# EAGLE design untitled (EAGLE 9.6.2)
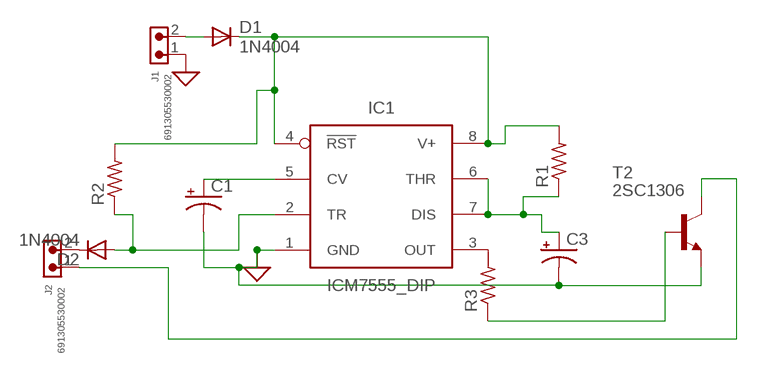
[diagram p0: schematic, sheet 1]

## Parts
C1  CAPACITOR-PE2.5-5  [E2,5-5]
C3  CAPACITOR-PE2.5-5  [E2,5-5]
D1  1N4004  [DO41-10]
D2  1N4004  [DO41-10]
IC1  ICM7555_DIP  [DIP826W53P254L959H508Q8B]
J1  691305530002  691305530002  [691305530002]
J2  691305530002  691305530002  [691305530002]
R1  R-US_0207/7  [0207/7]
R2  R-US_0207/7  [0207/7]
R3  R-US_0207/12  [0207/12]
T2  2SC1306  [TO220BV]

## Nets
GND: C1.- C3.- IC1.1(GND) J1.1 T2.3(E) ; supply symbol labelled SUP
N$1: D1.A J1.2
N$2: D1.C IC1.4(!RST) IC1.8(V+) R1.2 R2.2
N$3: C1.+ IC1.5(CV)
N$4: D2.C J2.2
N$5: C3.+ IC1.6(THR) IC1.7(DIS) R1.1
N$6: J2.1 T2.2(C)
N$7: D2.A IC1.2(TR) R2.1
N$8: IC1.3(OUT) R3.2
N$9: R3.1 T2.1(B)

## Library data of the parts
C1 C3 = BeagleBone_Blue_R3:CAPACITOR-P: POLARIZED CAPACITOR, American symbol
D1 D2 = adafruit:1N4004: DIODE General purpose 1N400x type rectifier (With bigger pads) http://www.ladyada.net/library/pcb/eaglelibrary.html
IC1 = IC_Clock-Timing:*555: TIMER 555 General purpose precision timers NE555 : Texas Datasheet <http://www.ti.com/general/docs/suppproductinfo.tsp?distId=10&gotoUrl=http%3A%2F%2Fwww.ti.com%2Flit%2Fgpn%2Fne555>, Diodes Incorporated Datasheet <https://www.diodes.com/assets/Datasheets/NE555_SA555_NA555.pdf> LM555 Datasheet <http://www.ti.com/general/docs/suppproductinfo.tsp?distId=10&gotoUrl=http%3A%2F%2Fwww.ti.com%2Flit%2Fgpn%2Flm555> LMC555 Datasheet <http://www.ti.com/general/docs/suppproductinfo.tsp?distId=10&gotoUrl=http%3A%2F%2Fwww.ti.com%2Flit%2Fgpn%2Flmc555> ICM7555 : Maxim Integrated Datasheet <https://datasheets.maximintegrated.com/en/ds/ICM7555-ICM7556.pdf>, Renesas Electronics America Inc Datasheet <https://www.renesas.com/en-us/www/doc/datasheet/icm7555-56.pdf>; CATEGORY: IC_Clock-Timing; CURRENT-SUPPLY: 60µA; DESCRIPTION: IC OSC SINGLE TIMER 1MHZ 8DIP; FREQUENCY: 1MHz; MANUFACTURER: Renesas Electronics America Inc; MPN: ICM7555IPAZ; OPERATING_TEMP: -25°C to 85°C; PART_STATUS: Active; ROHS_COMPLIANT: ROHS3 Compliant; SUB-CATEGORY: Timer
J1 J2 = Wurth_Connectors_WR-TBL Pluggable Connector:691305530002: WR-TBL Serie 3055 - 5,08 mm - PCB Header Vertical Entry with Plastic Latches KIND PROPERTIES Pitch 5.08 mm MATERIAL PROPERTIES Insulator Material PA66 Insulator Flammability Rating UL94 V-0 Insulator Color Green Terminal Material Copper Alloy Terminal Plating Tin-plated surface GENERAL INFORMATION Operating Temperature -40 up to +105 °C ELECTRICAL PROPERTIES IR UL 16 A Working Voltage [UL] 300 V (AC) Withstanding Voltage [UL] 2500 V (AC) Contact Resistance [UL] 20 mΩ CERTIFICATION UL Approval E315414 <https://www.we-online.com/catalog/media/o135349v209%20Family_WR-TBL3_6913055300xx.jpg> Details see: https://www.we-online.com/catalog/en/TBL_5_08_3055_6913055300XX/ Updated by Ella Wu 2019-12-30 2019(C) Wurth Elektronik; DATASHEET-URL: https://www.we-online.com/catalog/datasheet/691305530002.pdf; IR-UL: 16A; MOUNT: THT; PART-NUMBER: 691305530002; PINS: 2; PITCH: 5.08mm; TYPE: Vertical; WORKING-VOLTAGE-UL: 300V (AC)
R1 R2 = adafruit:R-US_: RESISTOR, American symbol
R3 = BeagleBone_Black_Wireless:R-US_: RESISTOR, American symbol
T2 = transistor-neu-to92:2SC1306: NPN Transistor Final RF Power Outupt Source: 2sc1306.pdf

## Board
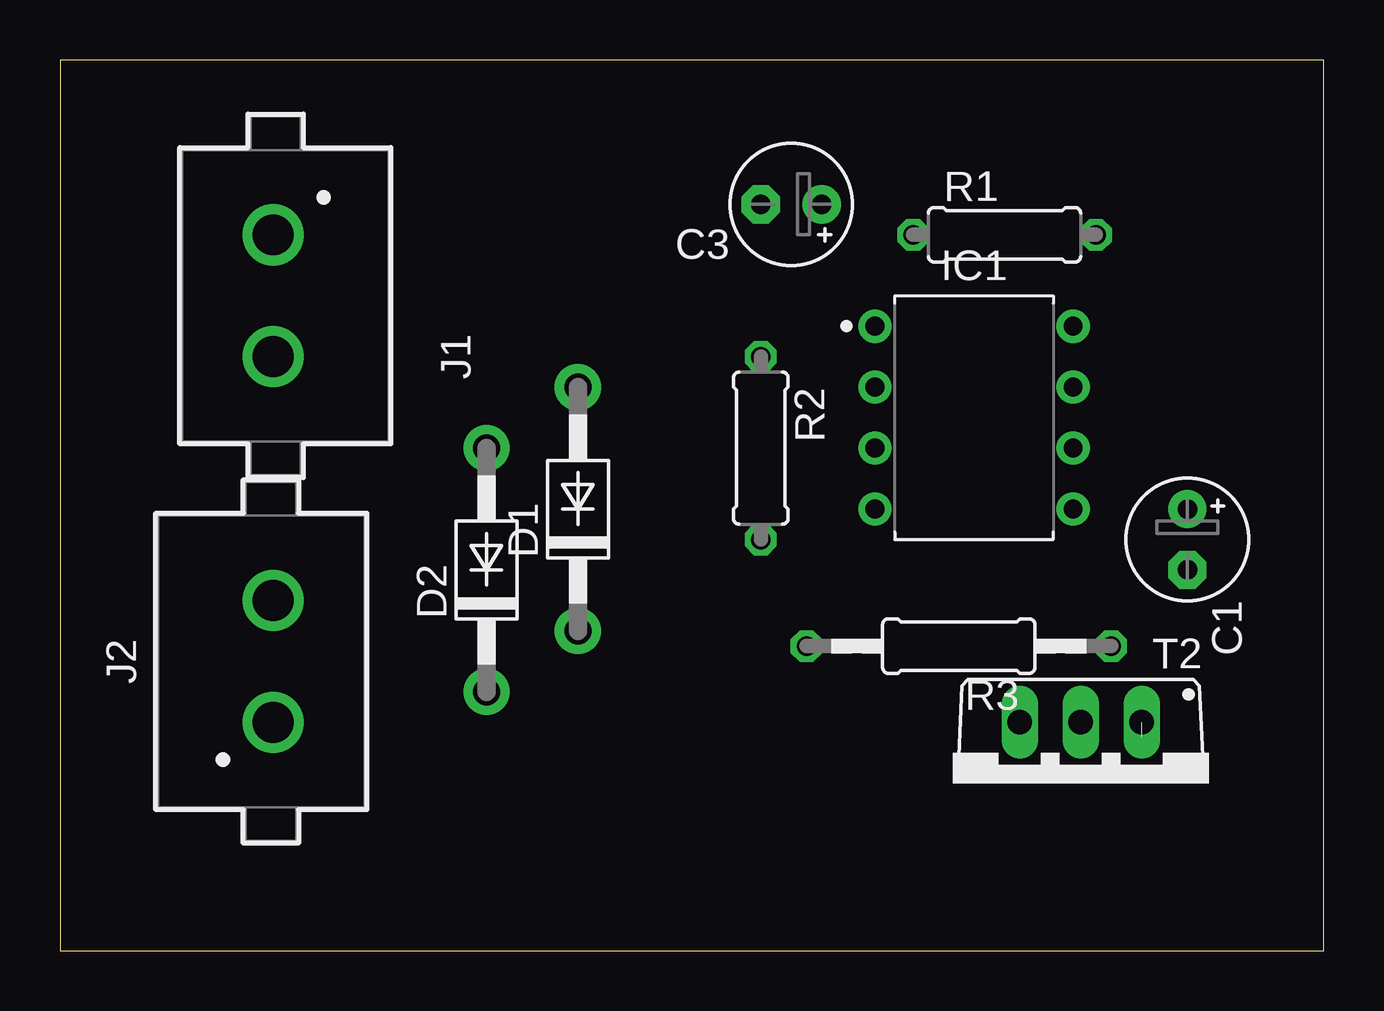
[diagram p1: board, top side]
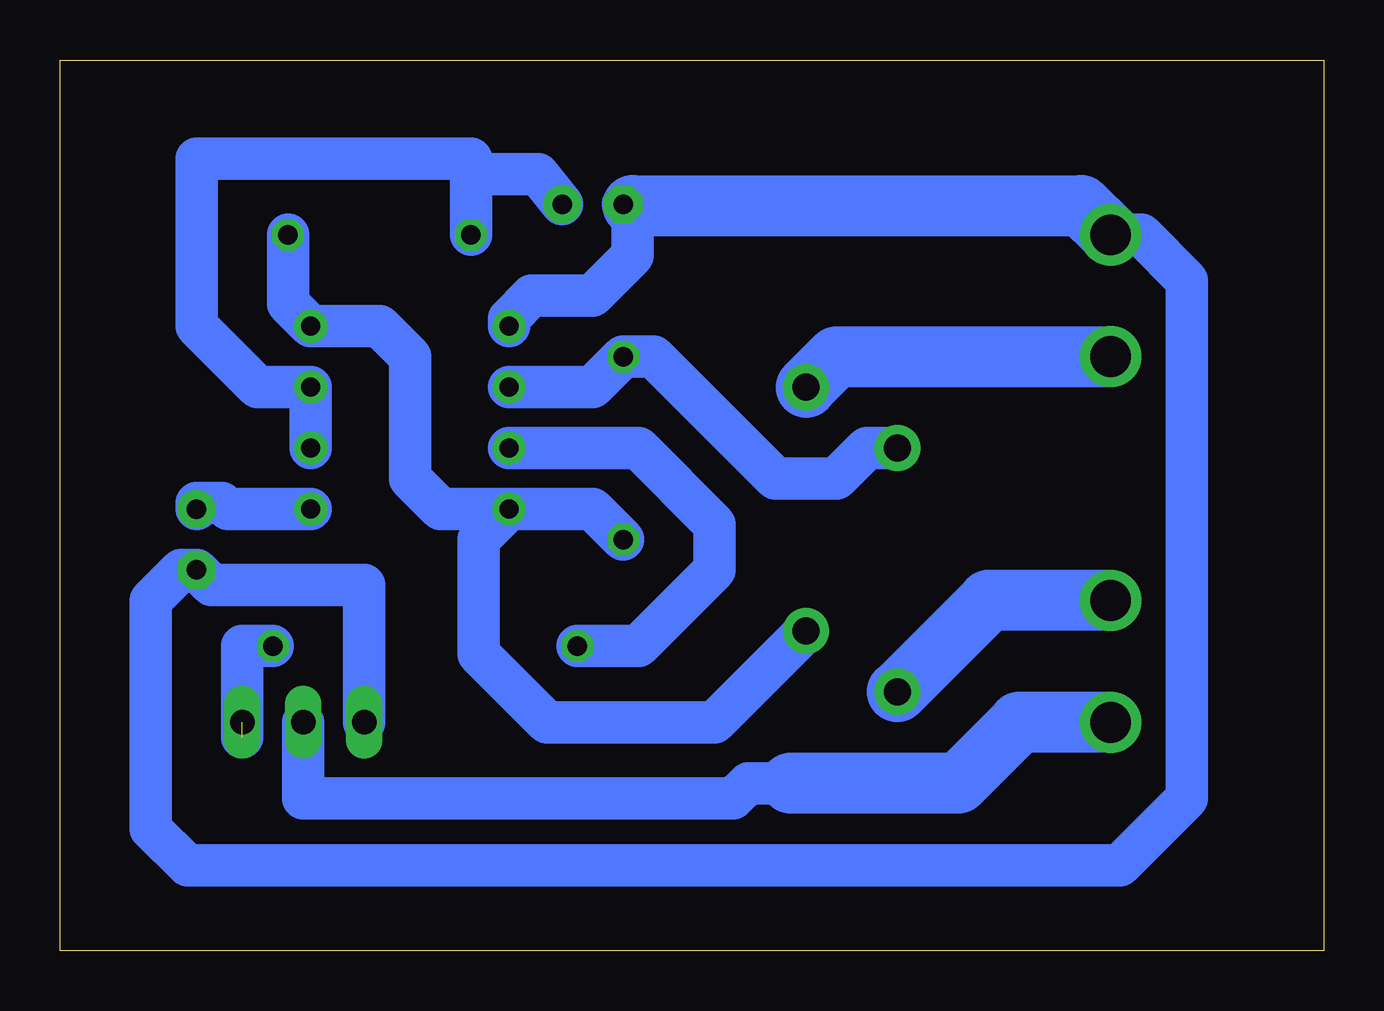
[diagram p2: board, bottom side, seen from below]

Size 52.69 x 37.13 mm. Coordinates in mm from the lower left corner, seen from the top.
Outline: 0,0 52.69,0 52.69,37.13 0,37.13 0,0
Copper layers (1*16): Top 0.035mm / dielectric 1.5mm / Bottom 0.035mm
Design rules "default *": minimum track width 6mil, minimum drill 0.35mm, track to track 40mil, track to pad 30mil, pad to pad 30mil, via to via 30mil, smd to smd 6mil, copper to edge 40mil, drill to drill 6mil, minimum pad ring 10mil, minimum via ring 8mil, stop-mask expansion 4mil, vias tented up to drill 0mil, thermal gap 10mil

### Footprints (pad centres in the part's own frame; a part is rotated, then mirrored left to right if it is on the bottom)
E2,5-5 = drill 0.813 pad 1.6: + -1.27,0 | drill 0.813 pad 1.6 octagon: - 1.27,0
DO41-10 = drill 1.118 pad 1.93: A 5.08,0; C -5.08,0
DIP826W53P254L959H508Q8B = drill 0.786 pad 1.386: 1 -4.13,3.81; 2 -4.13,1.27; 3 -4.13,-1.27; 4 -4.13,-3.81; 5 4.13,-3.81; 6 4.13,-1.27; 7 4.13,1.27; 8 4.13,3.81
691305530002 = drill 1.7: 1 -2.54,0; 2 2.54,0
0207/7 = drill 0.813 octagon: 1 -3.81,0; 2 3.81,0
0207/12 = drill 0.813 octagon: 1 -6.35,0; 2 6.35,0
TO220BV = drill 1.016 long: 1 -2.54,-2.54; 2 0,-2.54; 3 2.54,-2.54

### Placement (x,y rotation side)
C1  46.99,17.14 270 top
C3  30.48,31.12 180 top
D1  21.59,18.41 90 top
D2  17.78,15.88 90 top
IC1  38.1,22.22 0 top
J1  8.89,27.3 270 top
J2  8.89,12.07 90 top
R1  39.37,29.84 0 top
R2  29.21,20.95 270 top
R3  37.47,12.7 180 top
T2  42.55,6.99 180 top

### Tracks (layer width: path | path; a pad name or v marks a point on that pad's centre or on a via)
GND
  Bottom 1.778: IC1.1 33.97,26.36 33.02,27.3 30.48,27.3 28.82,28.97 28.82,31.07 29.17,31.07 C3.- | J1.1 7.62,29.84 5.71,27.94 5.71,6.35 8.51,3.56 47.37,3.56 48.9,5.08 48.9,14.61 47.62,15.88 C1.- 46.35,15.24 40.01,15.24 T2.3
  Bottom 2.54: J1.1 10.12,31.07 28.82,31.07
N$1
  Bottom 2.54: D1.A 20.32,24.77 J1.2
N$2
  Bottom 1.778: D1.C 25.4,9.53 32.38,9.53 35.24,12.38 35.24,17.14 IC1.4 | R2.2 30.48,18.41 IC1.4 | IC1.4 36.83,18.41 38.1,19.68 38.1,24.77 39.37,26.04 IC1.8 43.18,26.98 R1.2
N$3
  Bottom 1.016: 46.74,18.41 C1.+
  Bottom 1.778: IC1.5 45.68,18.41 45.94,18.67 46.99,18.67 C1.+
N$4
  Bottom 2.54: D2.C 13.97,14.61 J2.2
N$5
  Bottom 1.778: IC1.6 IC1.7 44.45,23.49 46.99,26.04 46.99,33.02 35.56,33.02 35.56,32.38 | C3.+ 32.77,32.38 35.56,32.38 | R1.1 35.56,32.38
N$6
  Bottom 1.778: T2.2 42.55,6.35 24.62,6.35 23.99,6.99 22.23,6.99
  Bottom 2.54: J2.1 12.7,9.53 15.24,6.99 22.23,6.99
N$7
  Bottom 1.778: IC1.2 30.48,23.49 R2.1 27.94,24.77 22.86,19.68 20.32,19.68 19.05,20.95 D2.A
N$8
  Bottom 1.778: IC1.3 28.57,20.95 25.4,17.78 25.4,15.88 28.57,12.7 R3.2
N$9  (1 unrouted)
  Bottom 1.778: R3.1 45.09,12.7 45.09,8.89